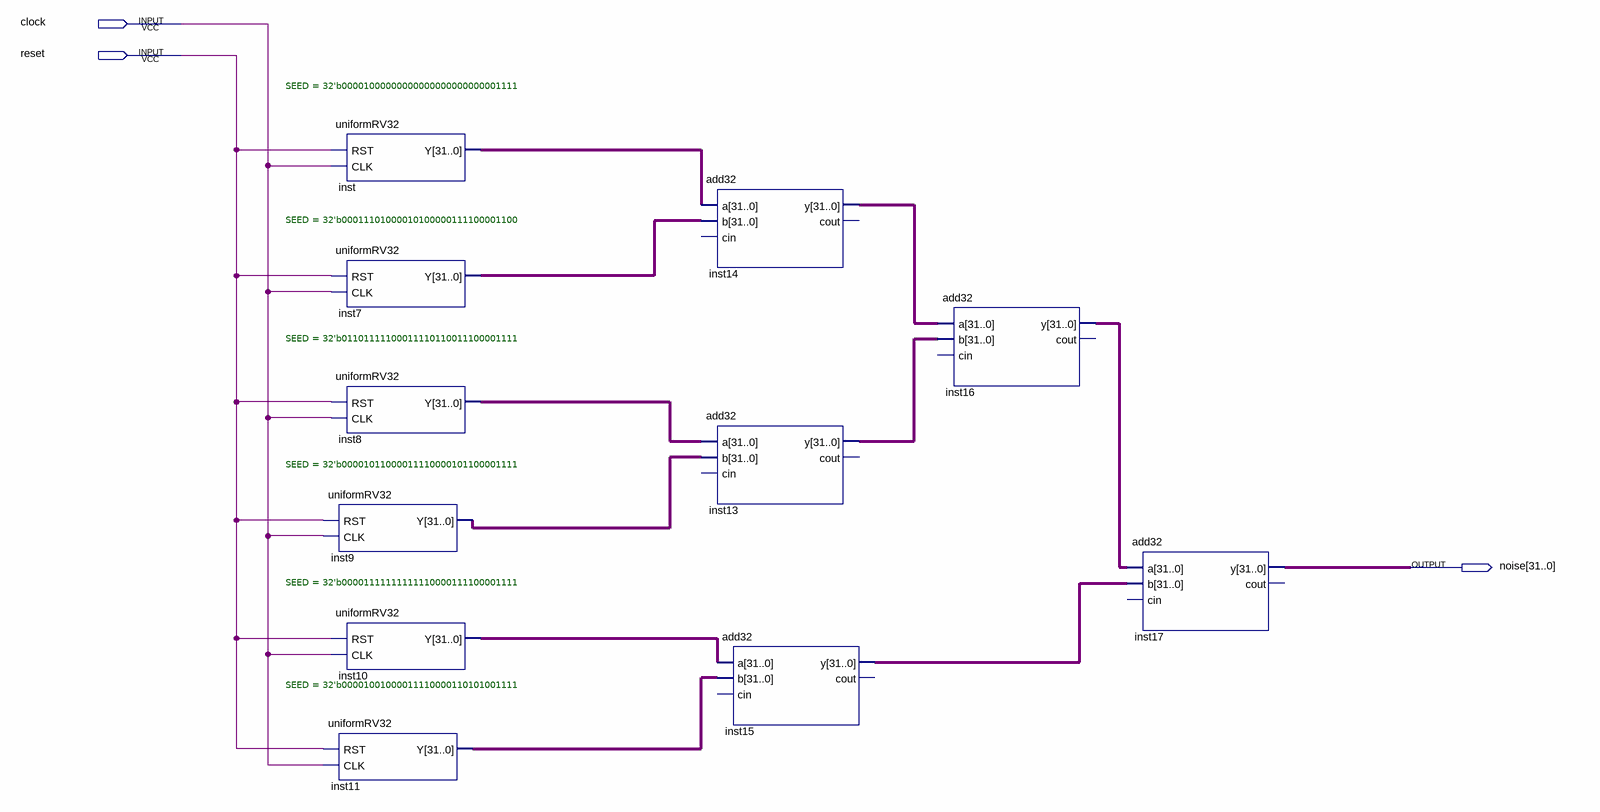
[diagram p0: schematic sheet]
// Quartus schematic noiseadder.bdf as structural Verilog: 11 symbols, 3 pins
module noiseadder (
  input  clock,
  input  reset,
  output [31:0] noise
);

  wire [31:0] inst7_y, inst8_y, inst9_y, inst10_y, inst11_y, inst13_y, inst14_y, inst15_y, inst16_y, inst_y;

  uniformRV32 #(.SEED(32'b00001000000000000000000000001111)) inst (.RST(reset), .CLK(clock), .Y(inst_y));
  uniformRV32 #(.SEED(32'b00011101000010100000111100001100)) inst7 (.RST(reset), .CLK(clock), .Y(inst7_y));
  uniformRV32 #(.SEED(32'b01101111100011110110011100001111)) inst8 (.RST(reset), .CLK(clock), .Y(inst8_y));
  uniformRV32 #(.SEED(32'b00001011000011110000101100001111)) inst9 (.RST(reset), .CLK(clock), .Y(inst9_y));
  uniformRV32 #(.SEED(32'b00001111111111110000111100001111)) inst10 (.RST(reset), .CLK(clock), .Y(inst10_y));
  uniformRV32 #(.SEED(32'b00001001000011110000110101001111)) inst11 (.RST(reset), .CLK(clock), .Y(inst11_y));
  add32 inst14 (.a(inst_y), .b(inst7_y), .y(inst14_y));  // open: cin, cout
  add32 inst13 (.a(inst8_y), .b(inst9_y), .y(inst13_y));  // open: cin, cout
  add32 inst15 (.a(inst10_y), .b(inst11_y), .y(inst15_y));  // open: cin, cout
  add32 inst16 (.a(inst14_y), .b(inst13_y), .y(inst16_y));  // open: cin, cout
  add32 inst17 (.a(inst16_y), .b(inst15_y), .y(noise));  // open: cin, cout
endmodule
